# Altium project CAN_USB_M_V1.PrjPcb
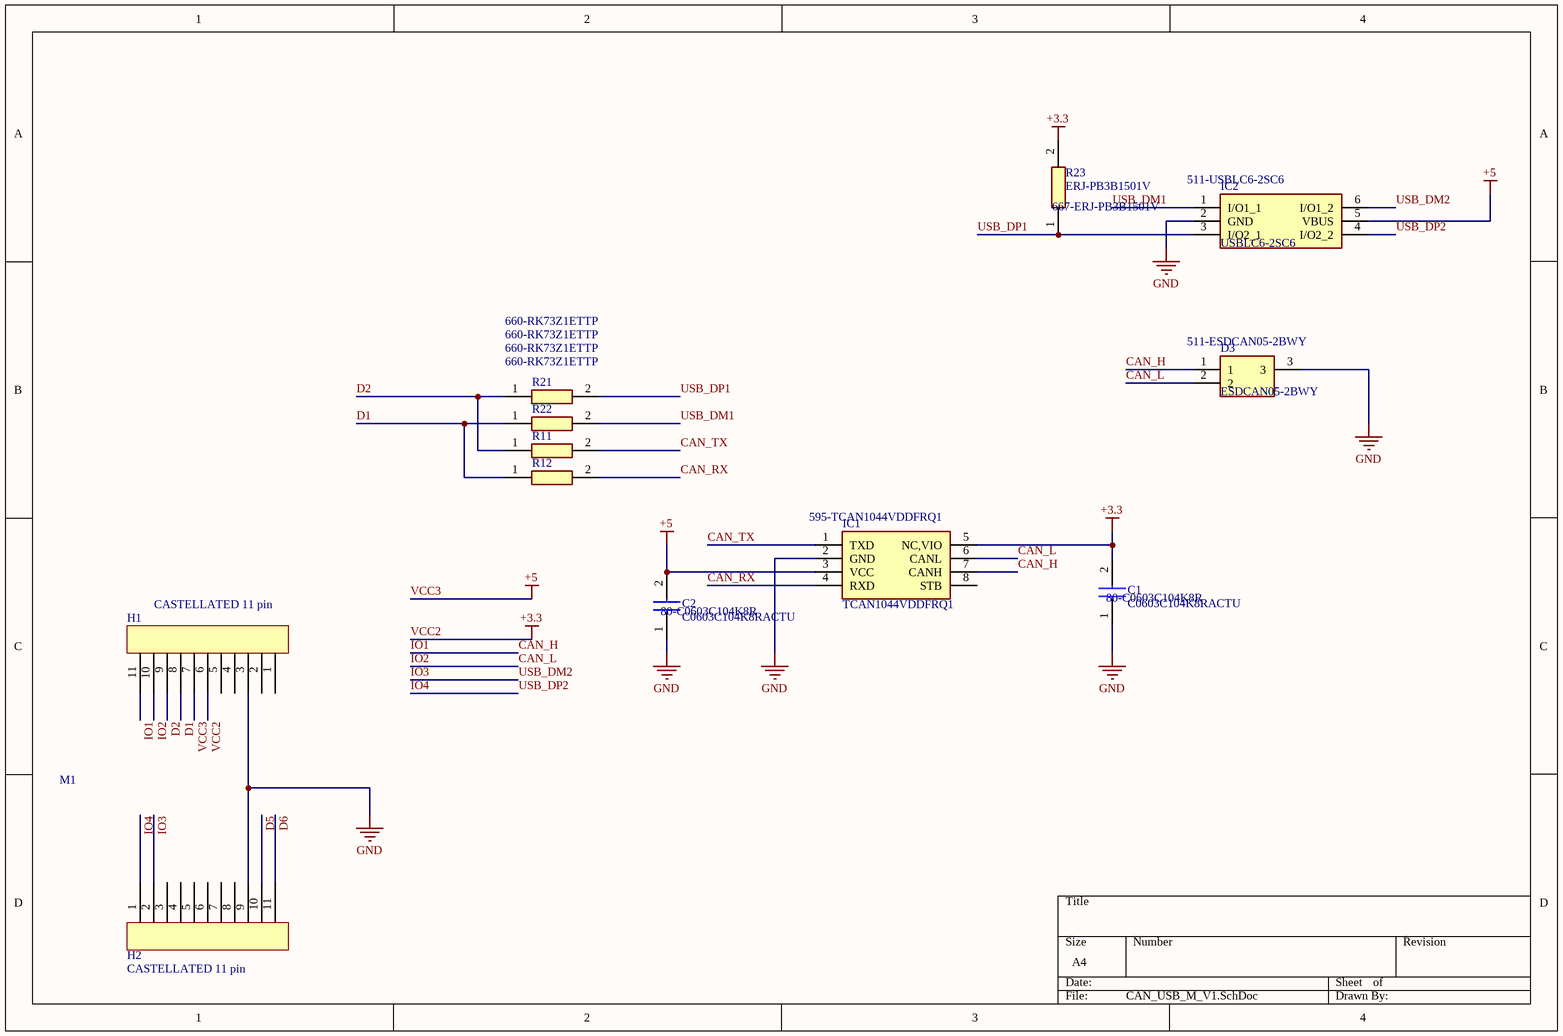
[diagram p0: CAN_USB_M_V1.SchDoc]
1 sheet, 12 parts. Net scope: global (net labels, ports and power ports of the same name join across sheets).
Board file: CAN_USB_M_V1.PcbDoc

## Sheet CAN_USB_M_V1.SchDoc
size A4

### Parts
C1  C0603C104K8RACTU  Supplier Part Number 1: 80-C0603C104K8R  [CAPC1608X90N]
C2  C0603C104K8RACTU  Supplier Part Number 1: 80-C0603C104K8R  [CAPC1608X90N]
D3  ESDCAN05-2BWY  Supplier Part Number 1: 511-ESDCAN05-2BWY  [SOT65P210X110-3N]
H1  CASTELLATED 11 pin  [CASTELLATED 11 pin]
H2  CASTELLATED 11 pin  [CASTELLATED 11 pin]
IC1  TCAN1044VDDFRQ1  Supplier Part Number 1: 595-TCAN1044VDDFRQ1  [SOT65P280X110-8N]
IC2  USBLC6-2SC6  Supplier Part Number 1: 511-USBLC6-2SC6  [SOT95P280X145-6N]
R11  Supplier Part Number 1: 660-RK73Z1ETTP  [RESC1005X40N]  (hidden comment: RK73Z1ETTP)
R12  Supplier Part Number 1: 660-RK73Z1ETTP  [RESC1005X40N]  (hidden comment: RK73Z1ETTP)
R21  Supplier Part Number 1: 660-RK73Z1ETTP  [RESC1005X40N]  (hidden comment: RK73Z1ETTP)
R22  Supplier Part Number 1: 660-RK73Z1ETTP  [RESC1005X40N]  (hidden comment: RK73Z1ETTP)
R23  ERJ-PB3B1501V  Supplier Part Number 1: 667-ERJ-PB3B1501V  [RESC1608X55N]

### Nets
GND: C1.1 C2.1 D3.3 H1.3 H2.9 IC1.2(GND) IC2.2(GND)
VCC2: C1.2 H1.6 IC1.5(NC,VIO) R23.2  [also labelled +3.3]
VCC3: C2.2 H1.7 IC1.3(VCC) IC2.5(VBUS)  [also labelled +5]
CAN_H: D3.1 H1.11 IC1.7(CANH)  [also labelled IO1]
CAN_L: D3.2 H1.10 IC1.6(CANL)  [also labelled IO2]
CAN_RX: IC1.4(RXD) R12.2
CAN_TX: IC1.1(TXD) R11.2
D1: H1.8 R12.1 R22.1
D2: H1.9 R11.1 R21.1
D5: H2.10
D6: H2.11
IO3: H2.2 IC2.6(I/O1_2)  [also labelled USB_DM2]
IO4: H2.1 IC2.4(I/O2_2)  [also labelled USB_DP2]
USB_DM1: IC2.1(I/O1_1) R22.2
USB_DP1: IC2.3(I/O2_1) R21.2 R23.1

Not connected (* = marked no-connect by the designer): H1 1 2 4 5; H2 3 4 5 6 7 8; IC1 8(STB)

### Notes on the sheet
- M1

### Library data of the parts
C1 C2 = C0603C104K8RACTU: Capacitor; Manufacturer_Name: Kemet; Datasheet Link: https://search.kemet.com/component-edge/download/specsheet/C0603C104K8RACTU.pdf; Height: 0.9mm; Manufacturer_Part_Number: C0603C104K8RACTU; Supplier 1: Mouser
D3 = ESDCAN05-2BWY: TVS Diode (Bi-directional); Manufacturer_Name: STMicroelectronics; Datasheet Link: https://componentsearchengine.com//ESDCAN05-2BWY.pdf; Height: 1.1mm; Mouser2 Part Number: 511-ESDCAN05-2BWY; Mouser2 Price/Stock: https://www.mouser.com/Search/Refine.aspx?Keyword=511-ESDCAN05-2BWY; Manufacturer_Part_Number: ESDCAN05-2BWY; Supplier 1: Mouser
IC1 = TCAN1044VDDFRQ1: Integrated Circuit; Manufacturer_Name: Texas Instruments; Datasheet Link: https://www.ti.com/lit/gpn/TCAN1044V-Q1; Height: 1.1mm; Manufacturer_Part_Number: TCAN1044VDDFRQ1; Supplier 1: Mouser
IC2 = USBLC6-2SC6: Integrated Circuit; Manufacturer_Name: STMicroelectronics; Datasheet Link: https://componentsearchengine.com//USBLC6-2SC6.pdf; Height: 1.45mm; Mouser2 Part Number: 511-USBLC6-2SC6; Mouser2 Price/Stock: https://www.mouser.com/Search/Refine.aspx?Keyword=511-USBLC6-2SC6; Manufacturer_Part_Number: USBLC6-2SC6; Supplier 1: Mouser
R11 R12 R21 R22 = RK73Z1ETTP: Resistor; Manufacturer_Name: KOA Speer; Height: 0.4mm; Manufacturer_Part_Number: RK73Z1ETTP; Supplier 1: Mouser
R23 = ERJ-PB3B1501V: Resistor; Manufacturer_Name: Panasonic; Datasheet Link: https://industrial.panasonic.com/cdbs/www-data/pdf/RDM0000/AOA0000C328.pdf; Height: 0.55mm; Manufacturer_Part_Number: ERJ-PB3B1501V; Supplier 1: Mouser

## Assembly variants
CAN_USB_M_V1 VAR1: alternate parts D3 -> ESDCAN04-2BWY